# EAGLE design vin-5v-regulator (EAGLE 9.6.2)
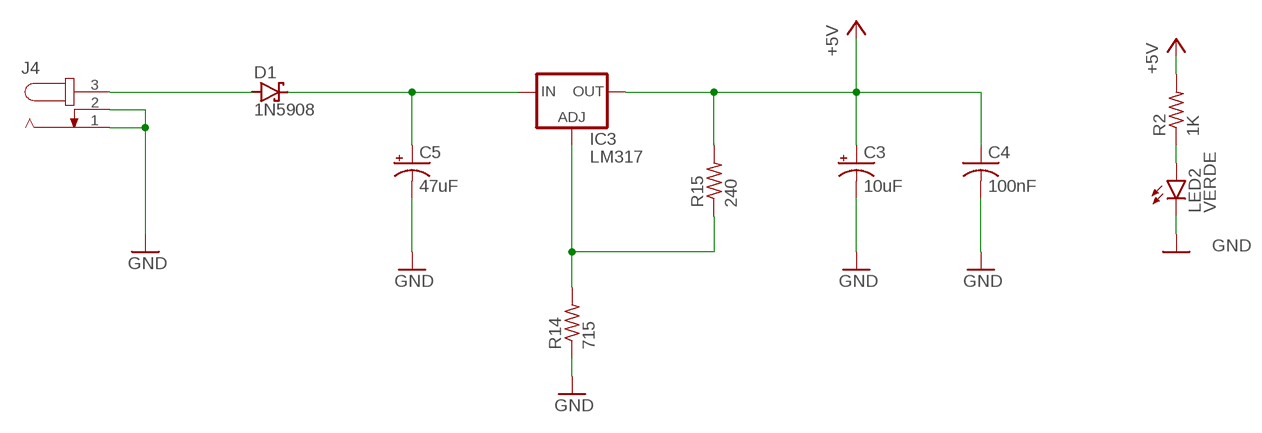
[diagram p0: schematic, sheet 1]

## Parts
C3  10uF  CPOL-USE2,5-6E  [E2,5-6E]
C4  100nF  C-US025-030X050  [C025-030X050]
C5  47uF  CPOL-USE2,5-6E  [E2,5-6E]
D1  1N5908  [C4111-15]
IC3  LM317  LM317TS  [317TS]
J4  JACK-PLUG0  [SPC4077]
LED2  VERDE  LED5MM  [LED5MM]
R2  1K  R-US_0207/10  [0207/10]
R14  715  R-US_0207/10  [0207/10]
R15  240  R-US_0207/10  [0207/10]

## Nets
+5V: C3.+ C4.1 IC3.2(OUT) R2.2 R15.2
GND: C3.- C4.2 C5.- J4.1 J4.2 LED2.K(C) R14.1
N$1: D1.A J4.3
N$2: C5.+ D1.C IC3.3(IN)
N$3: IC3.1(ADJ) R14.2 R15.1
N$4: LED2.A R2.1

## Library data of the parts
C3 C5 = rcl:CPOL-US: POLARIZED CAPACITOR, American symbol; SPICEPREFIX: C
C4 = rcl:C-US: CAPACITOR, American symbol; SPICEPREFIX: C
D1 = diode:1N5908: DIODE schottky
IC3 = v-reg:LM317TS: VOLTAGE REGULATOR
J4 = con-jack:JACK-PLUG: DC POWER JACK Power Jack, DC, Right Angle, Through Hole, Rated 5A at 16VDC, PC Terminals Distributor: Farnell (www.Farnell.de) Drawing: 84N1161.pdf / 84N1162.pdf Manufacturer: SPC Technology (www.spctechnology.com) Type: SPC4077 / SPC 4078; OC_FARNELL: unknown; OC_NEWARK: unknown
LED2 = led:LED: LED OSRAM: - CHIPLED LG R971, LG N971, LY N971, LG Q971, LY Q971, LO R971, LY R971 LH N974, LH R974 LS Q976, LO Q976, LY Q976 LO Q996 - Hyper CHIPLED LW Q18S LB Q993, LB Q99A, LB R99A - SideLED LS A670, LO A670, LY A670, LG A670, LP A670 LB A673, LV A673, LT A673, LW A673 LH A674 LY A675 LS A676, LA A676, LO A676, LY A676, LW A676 LS A679, LY A679, LG A679 - Hyper Micro SIDELED® LS Y876, LA Y876, LO Y876, LY Y876 LT Y87S - SmartLED LW L88C, LW L88S LB L89C, LB L89S, LG L890 LS L89K, LO L89K, LY L89K LS L896, LA L896, LO L896, LY L896 - TOPLED LS T670, LO T670, LY T670, LG T670, LP T670 LSG T670, LSP T670, LSY T670, LOP T670, LYG T670 LG T671, LOG T671, LSG T671 LB T673, LV T673, LT T673, LW T673 LH T674 LS T676, LA T676, LO T676, LY T676, LB T676, LH T676, LSB T676, LW T676 LB T67C, LV T67C, LT T67C, LS T67K, LO T67K, LY T67K, LW E67C LS E67B, LA E67B, LO E67B, LY E67B, LB E67C, LV E67C, LT E67C LW T67C LS T679, LY T679, LG T679 LS T770, LO T770, LY T770, LG T770, LP T770 LB T773, LV T773, LT T773, LW T773 LH T774 LS E675, LA E675, LY E675, LS T675 LS T776, LA T776, LO T776, LY T776, LB T776 LHGB T686 LT T68C, LB T68C - Hyper Mini TOPLED® LB M676 - Mini TOPLED Santana® LG M470 LS M47K, LO M47K, LY M47K Source: http://www.osram.convergy.de LUXEON: - LUMILED® LXK2-PW12-R00, LXK2-PW12-S00, LXK2-PW14-U00, LXK2-PW14-V00 LXK2-PM12-R00, LXK2-PM12-S00, LXK2-PM14-U00 LXK2-PE12-Q00, LXK2-PE12-R00, LXK2-PE12-S00, LXK2-PE14-T00, LXK2-PE14-U00 LXK2-PB12-K00, LXK2-PB12-L00, LXK2-PB12-M00, LXK2-PB14-N00, LXK2-PB14-P00, LXK2-PB14-Q00 LXK2-PR12-L00, LXK2-PR12-M00, LXK2-PR14-Q00, LXK2-PR14-R00 LXK2-PD12-Q00, LXK2-PD12-R00, LXK2-PD12-S00 LXK2-PH12-R00, LXK2-PH12-S00 LXK2-PL12-P00, LXK2-PL12-Q00, LXK2-PL12-R00 Source: www.luxeon.com KINGBRIGHT: KA-3528ASYC Source: www.kingbright.com
R2 R14 R15 = rcl:R-US_: RESISTOR, American symbol; SPICEPREFIX: R

## Board
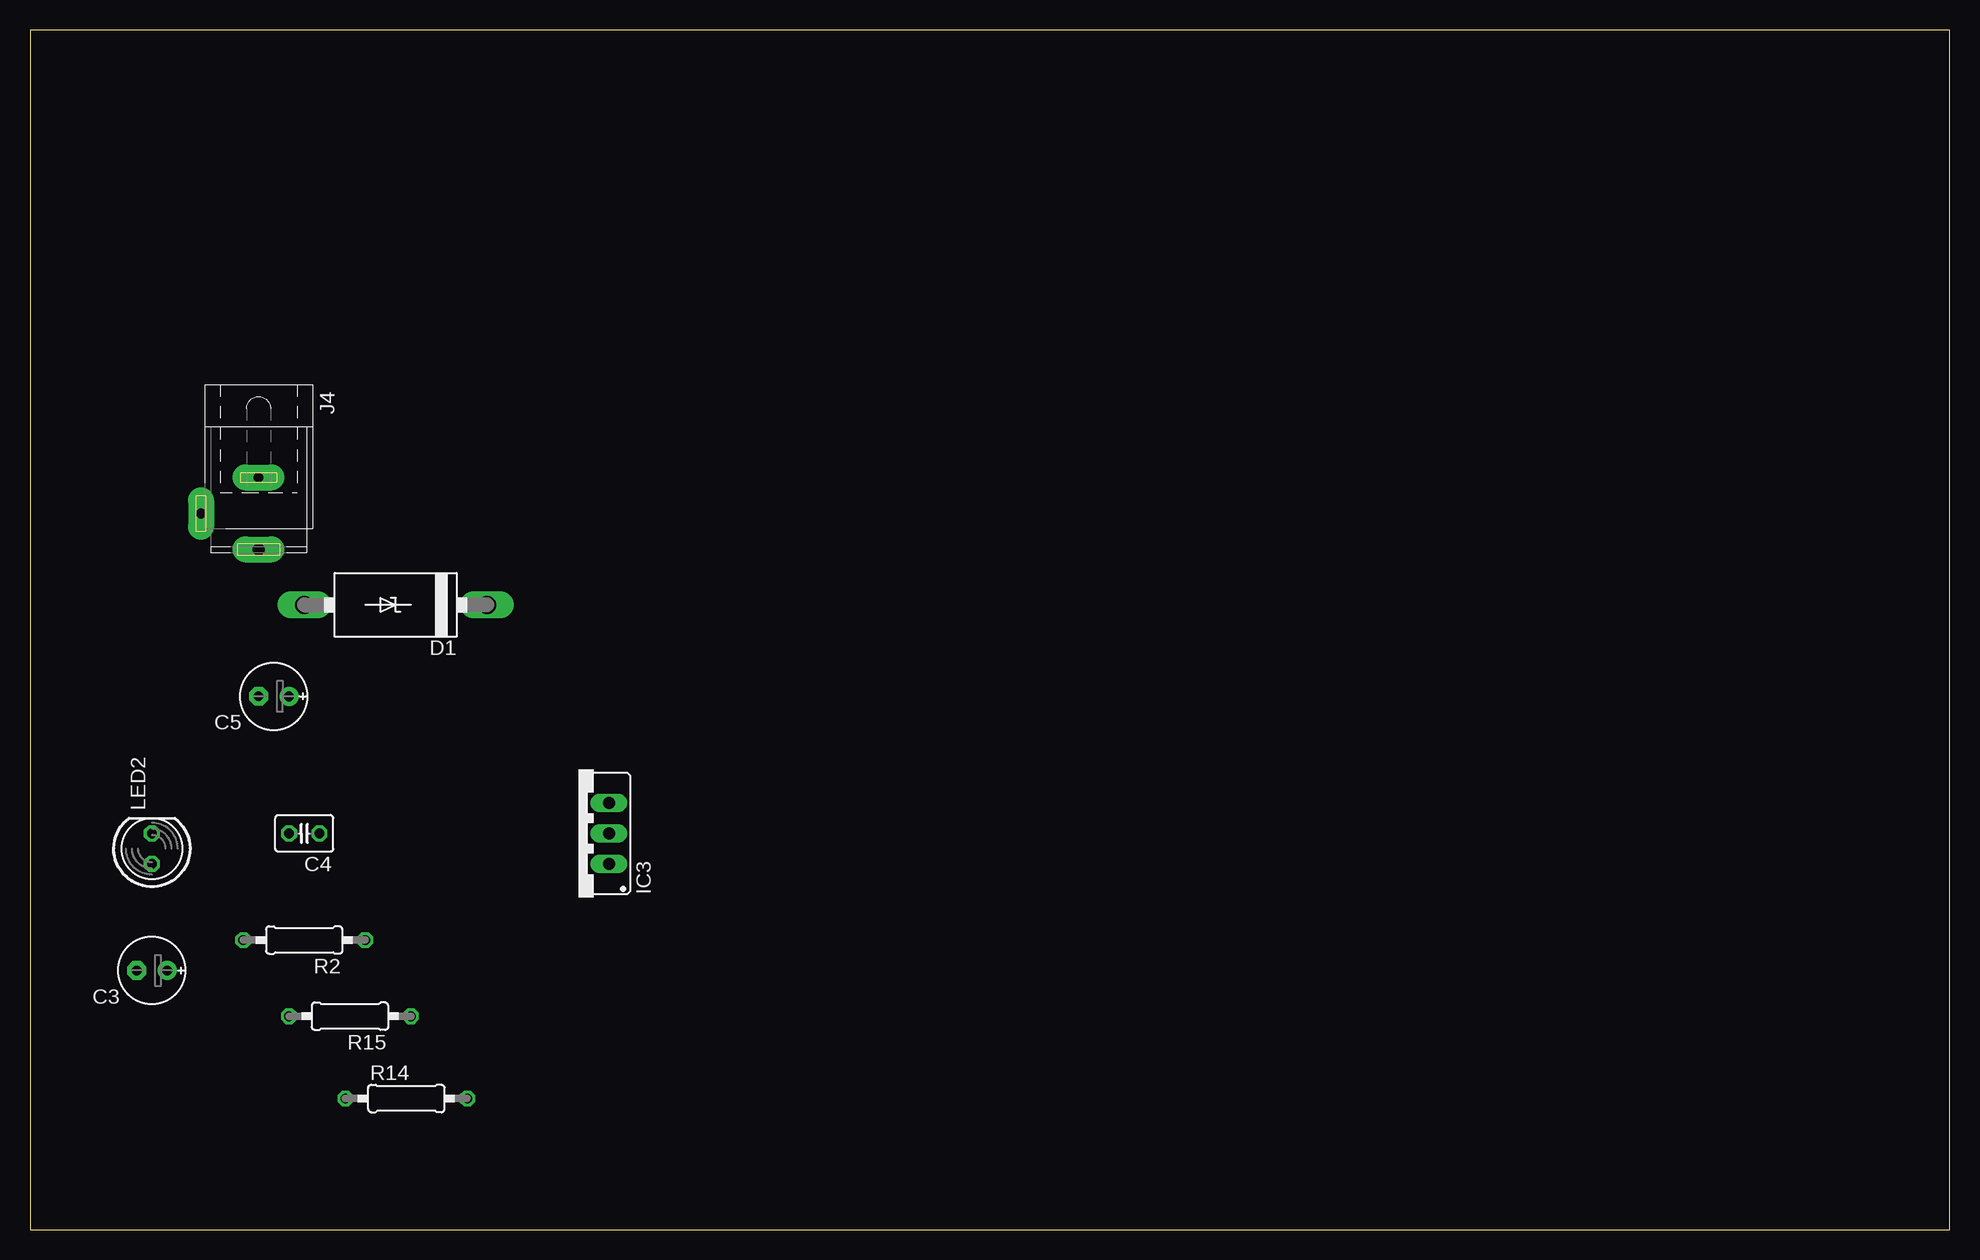
[diagram p1: board, top side]
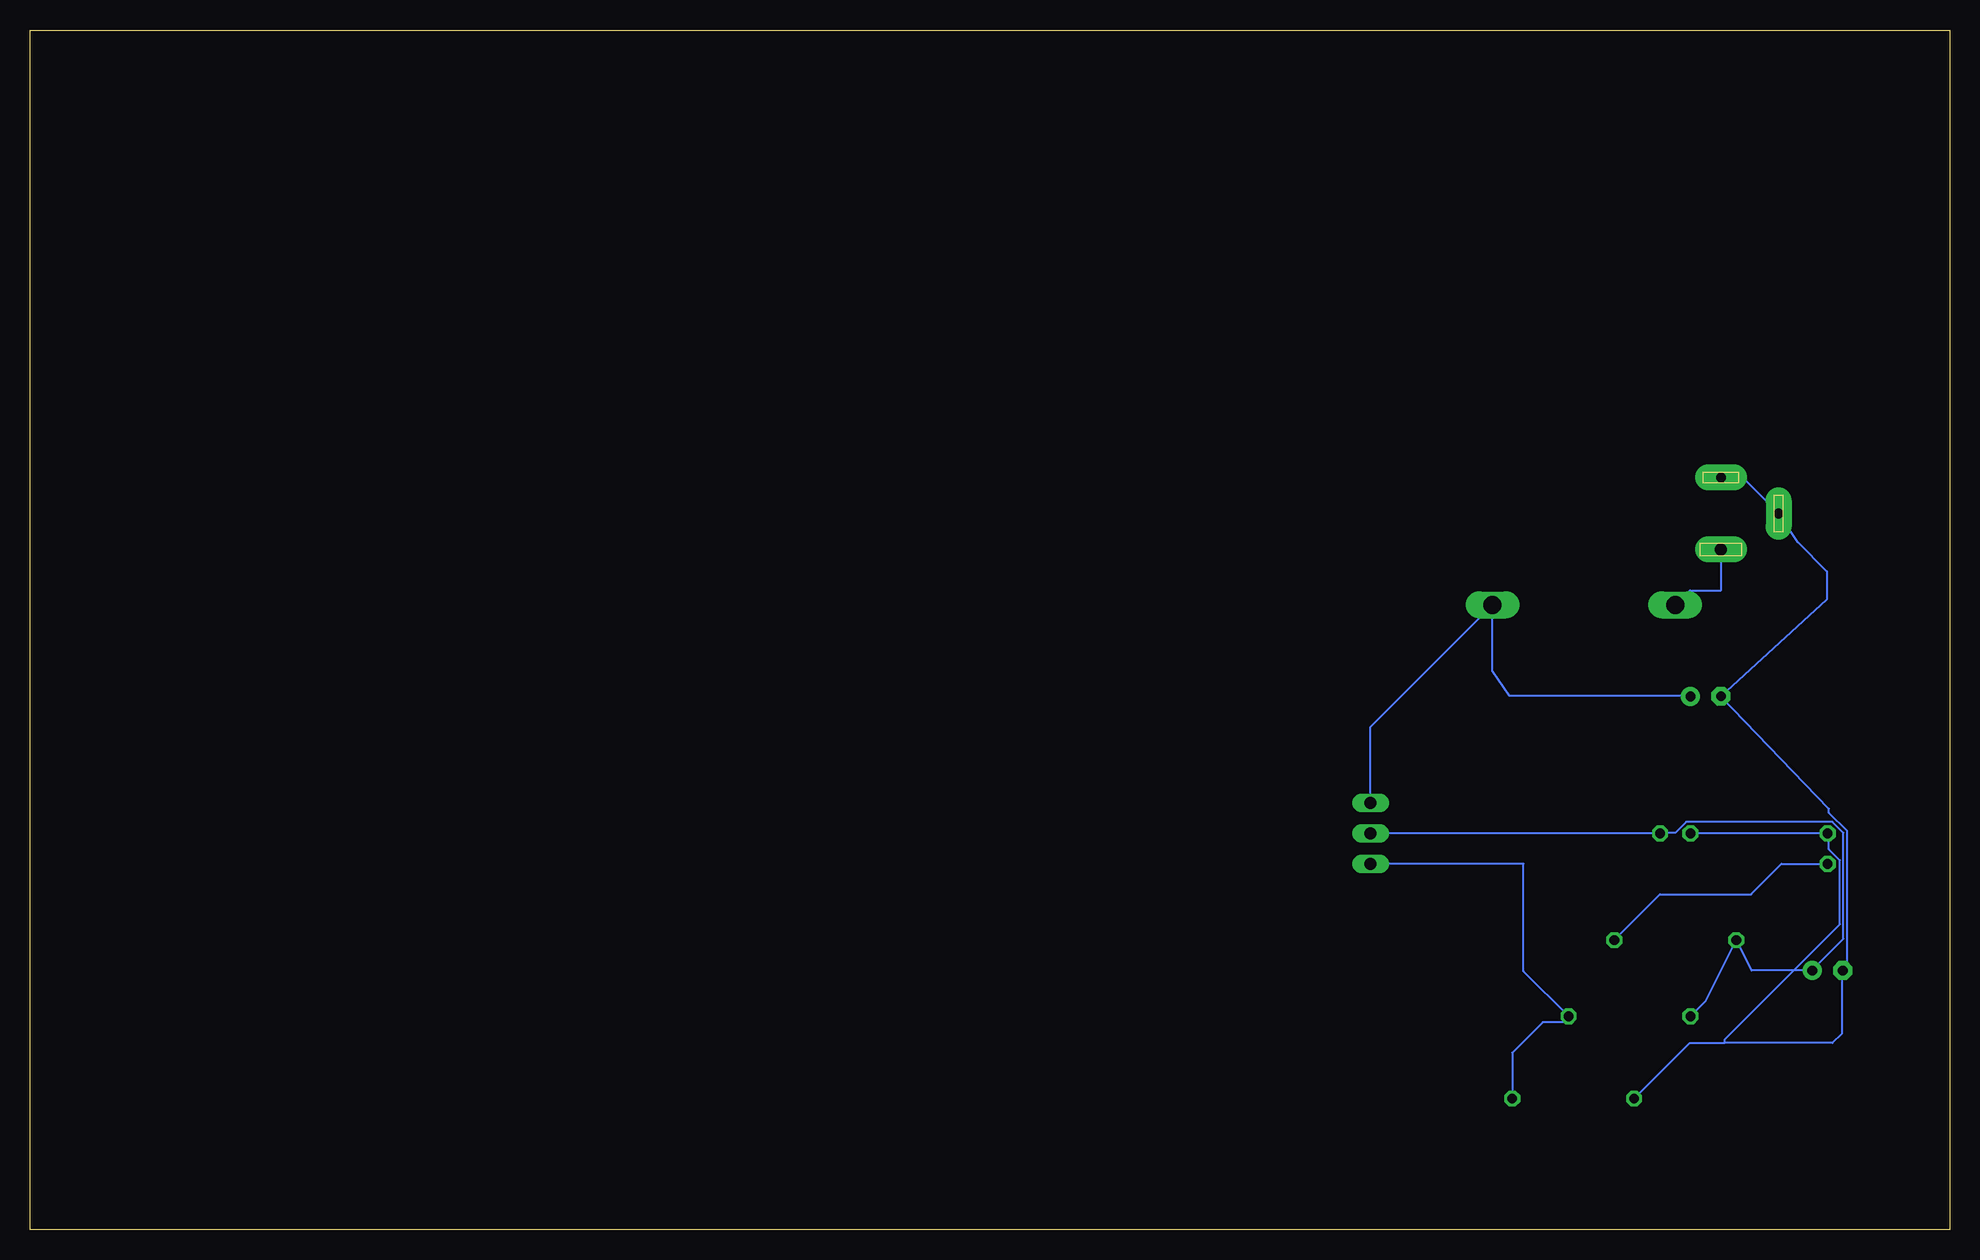
[diagram p2: board, bottom side, seen from below]

Size 160 x 100 mm. Coordinates in mm from the lower left corner, seen from the top.
Outline: 0,0 160,0 160,100 0,100 0,0
Copper layers (1*16): Top 0.035mm / dielectric 1.5mm / Bottom 0.035mm
Design rules "default": minimum track width 6mil, minimum drill 0.35mm, track to track 6mil, track to pad 6mil, pad to pad 6mil, via to via 6mil, smd to smd 6mil, copper to edge 40mil, drill to drill 6mil, minimum pad ring 10mil, minimum via ring 8mil, stop-mask expansion 4mil, vias tented up to drill 0mil, thermal gap 10mil

### Footprints (pad centres in the part's own frame; a part is rotated, then mirrored left to right if it is on the bottom)
E2,5-6E = drill 0.813 pad 1.575: + -1.27,0 | drill 0.813 pad 1.575 octagon: - 1.27,0
C025-030X050 = drill 0.813 octagon: 1 -1.27,0; 2 1.27,0
C4111-15 = drill 1.499 long: A 7.62,0; C -7.62,0
317TS = drill 1.016 long: 1 -2.54,-2.54; 2 0,-2.54; 3 2.54,-2.54
SPC4077 = drill 0.8 pad 2.184 long: 1 -3,0; 2 0,-4.8 | drill 1 pad 2.184 long: 3 3,0
LED5MM = drill 0.813 octagon: A -1.27,0; K 1.27,0
0207/10 = drill 0.813 octagon: 1 -5.08,0; 2 5.08,0

### Placement (x,y rotation side)
C3  10.16,21.59 180 top
C4  22.86,33.02 180 top
C5  20.32,44.45 179.8 top
D1  30.48,52.07 180 top
IC3  45.72,33.02 90 top
J4  19.05,59.69 270 top
LED2  10.16,31.75 90 top
R2  22.86,24.13 180 top
R14  31.37,10.92 0 top
R15  26.67,17.78 180 top

### Tracks (layer width: path | path; a pad name or v marks a point on that pad's centre or on a via)
+5V
  Bottom 0.152: IC3.2 48.21,33.07 24.23,33.07 C4.1 24.08,33.07 22.86,33.07 21.95,33.98 9.75,33.98 8.84,33.07 8.84,24.23 11.43,21.64 C3.+ 16.51,21.59 R2.2 20.32,19.05 R15.2
GND
  Bottom 0.152: J4.1 17.37,62.69 17.37,62.81 J4.2 12.65,57.3 10.21,54.86 10.21,52.52 C5.- 10.06,35.07 10.06,34.75 8.53,33.22 8.53,21.95 C3.- 8.99,21.49 8.99,16.31 9.75,15.54 18.75,15.54 | C4.2 21.49,33.07 10.21,33.07 LED2.K 10.06,32.92 10.06,31.7 9.14,30.79 9.14,25.45 18.75,15.85 18.75,15.54 | R14.1 21.67,15.54 18.75,15.54
N$1
  Bottom 0.152: D1.A 21.64,53.29 19.05,53.29 J4.3
N$2
  Bottom 0.152: IC3.3 48.26,41.91 D1.C 38.1,46.5 36.73,44.5 21.69,44.5 C5.+
N$3
  Bottom 0.152: R14.2 36.45,14.73 33.91,17.27 31.75,17.27 R15.1 35.51,21.54 35.51,30.48 IC3.1
N$4
  Bottom 0.152: R2.1 24.13,27.94 16.51,27.94 16.54,27.96 14.02,30.48 LED2.A